# EAGLE schematic POCN_Vrevised (EAGLE 9.6.2)
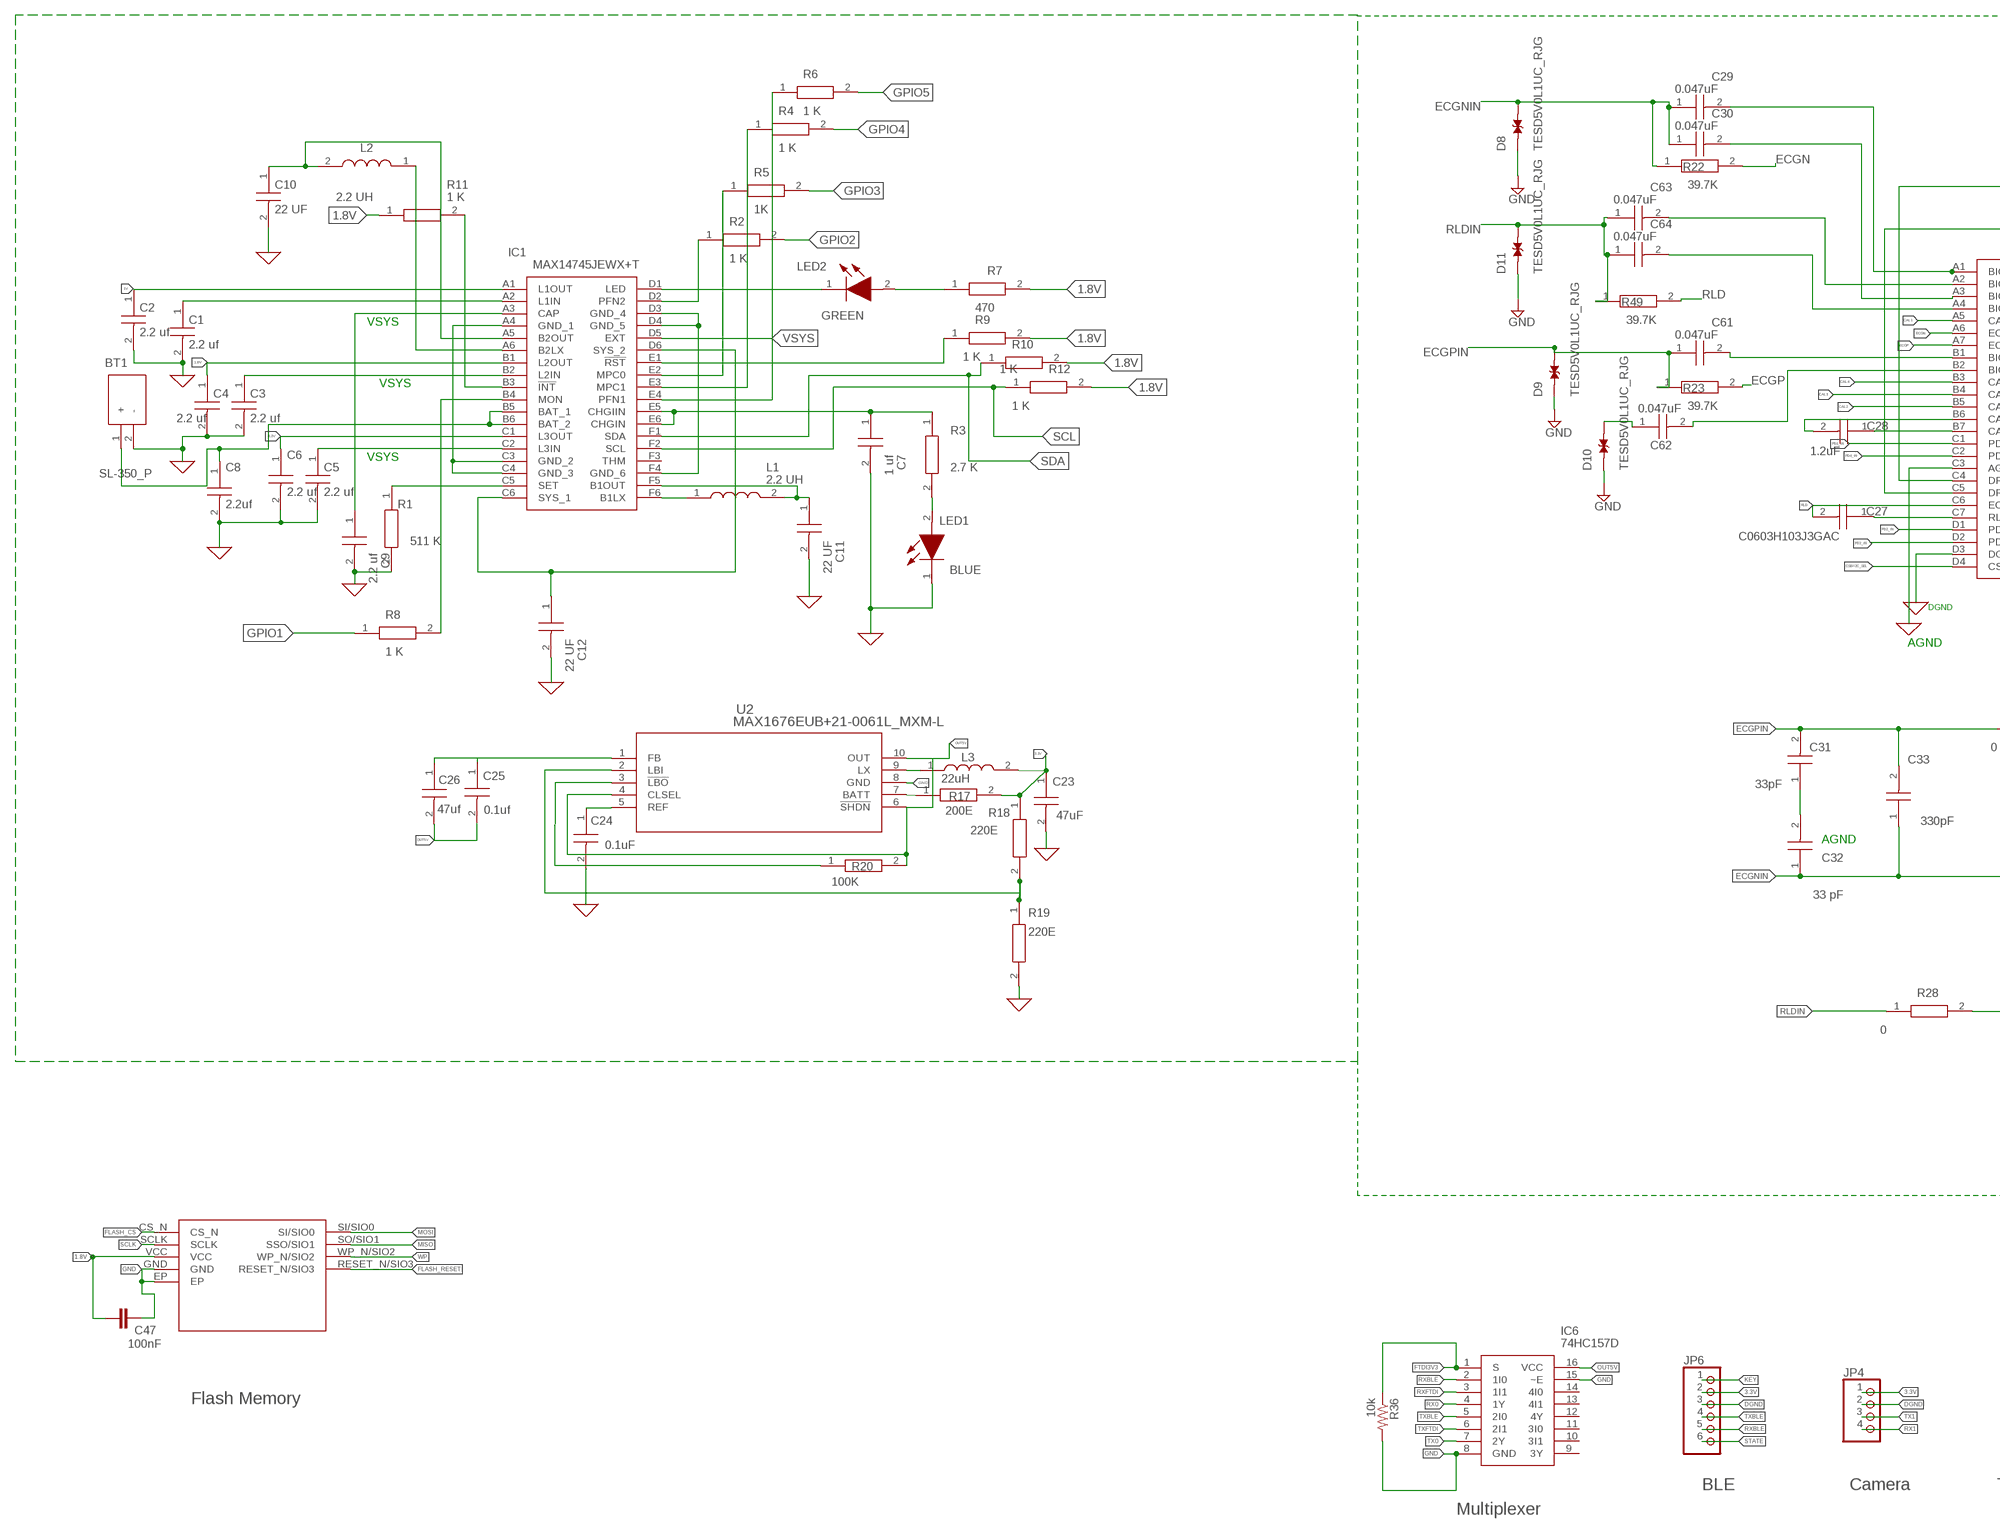
[diagram p0: schematic, sheet 1, part 1 of 3]
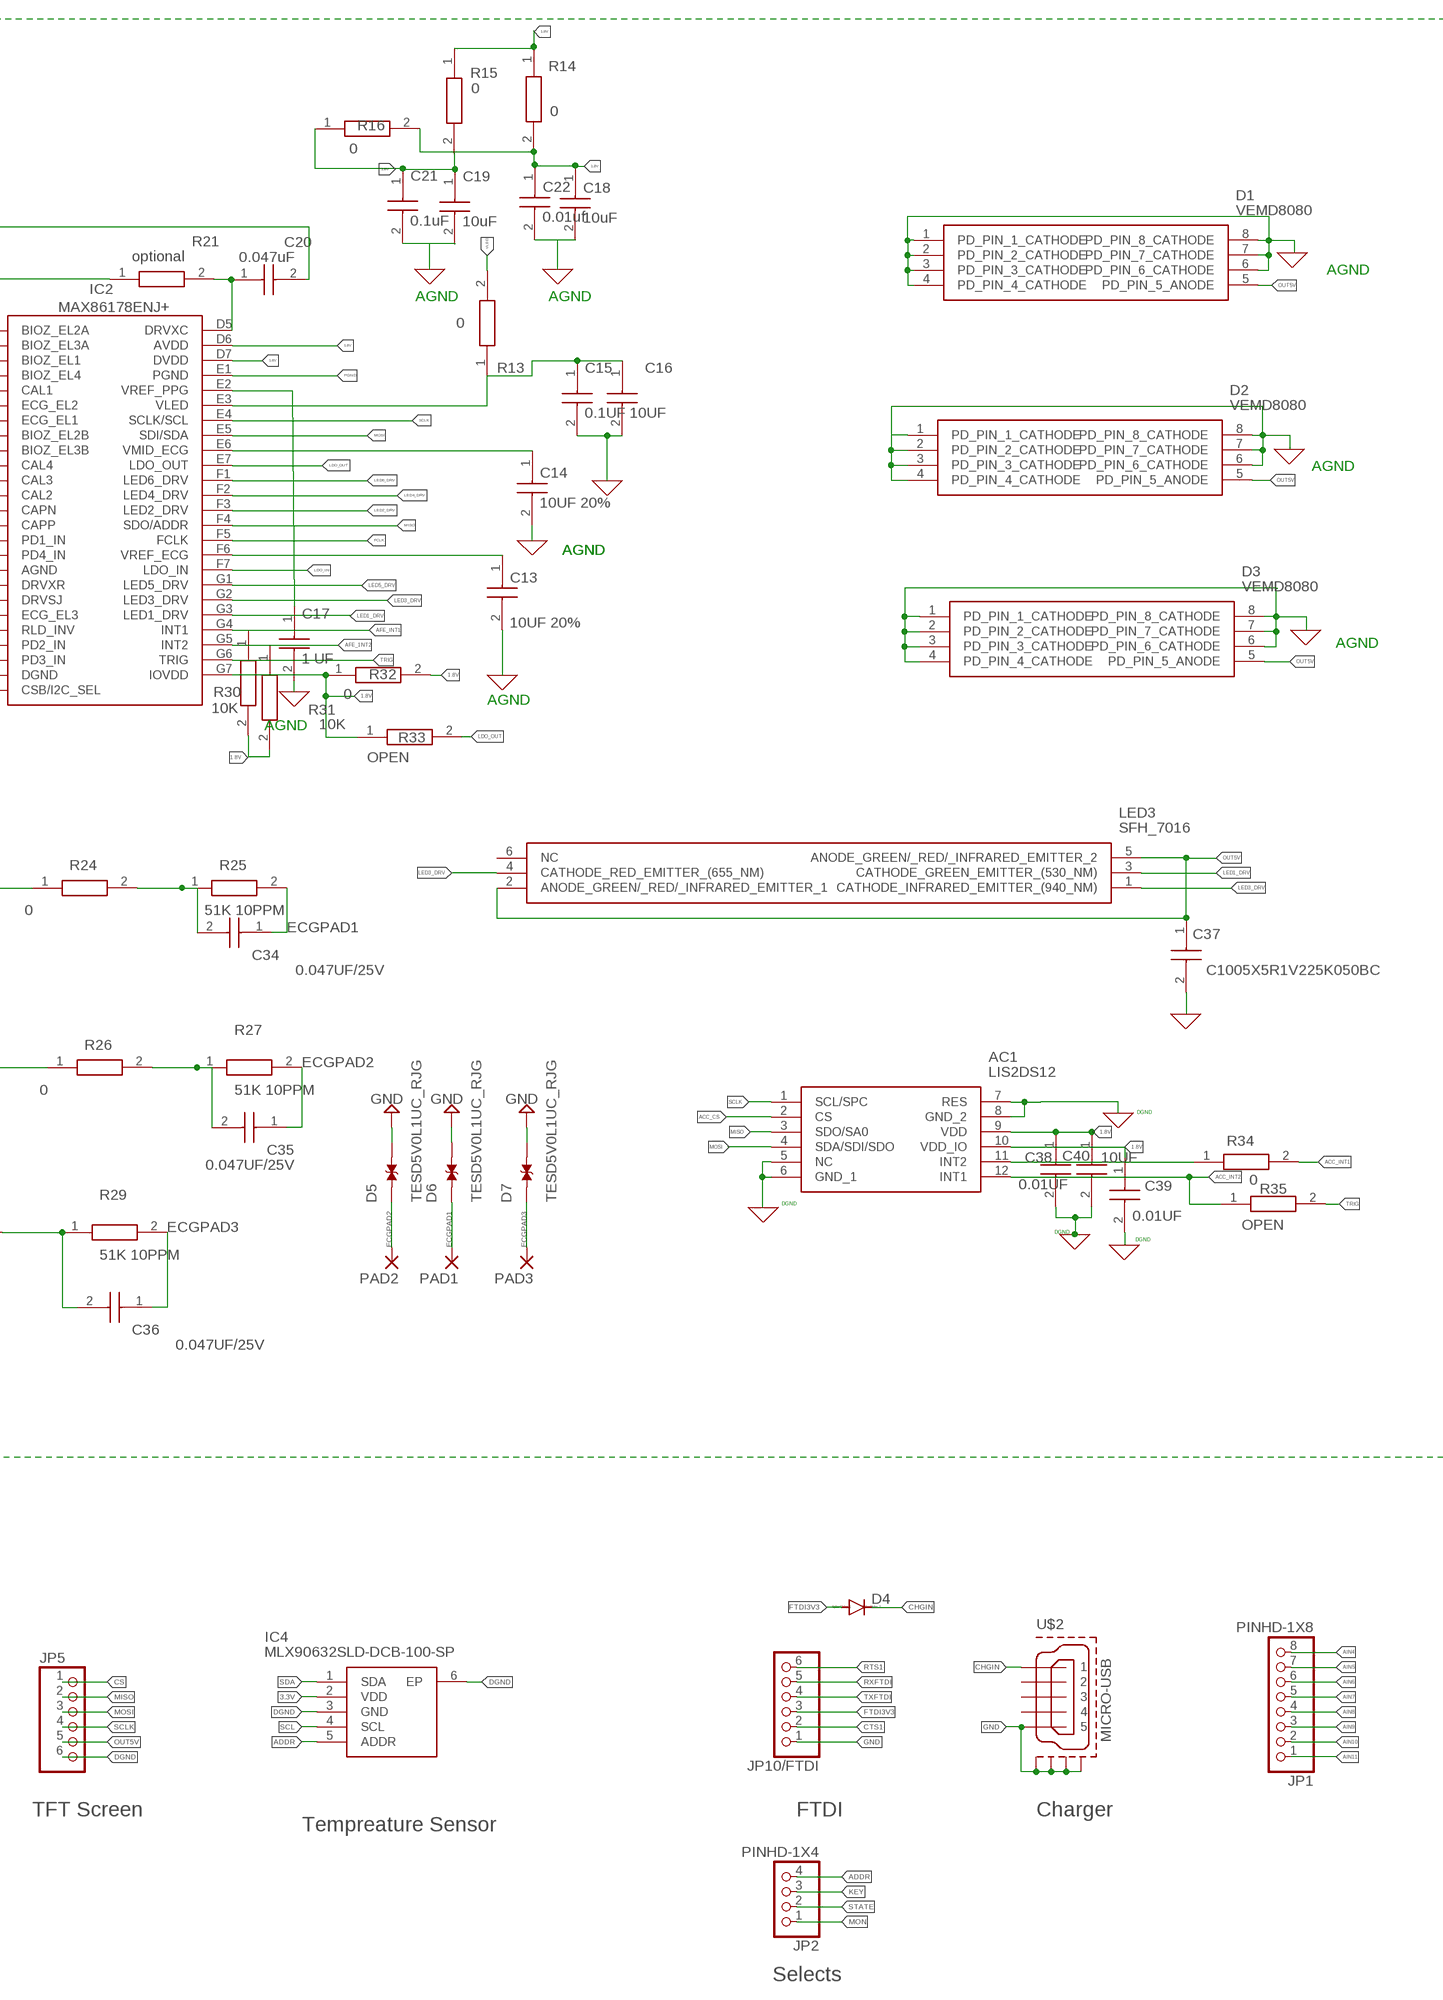
[diagram p1: schematic, sheet 1, part 2 of 3]
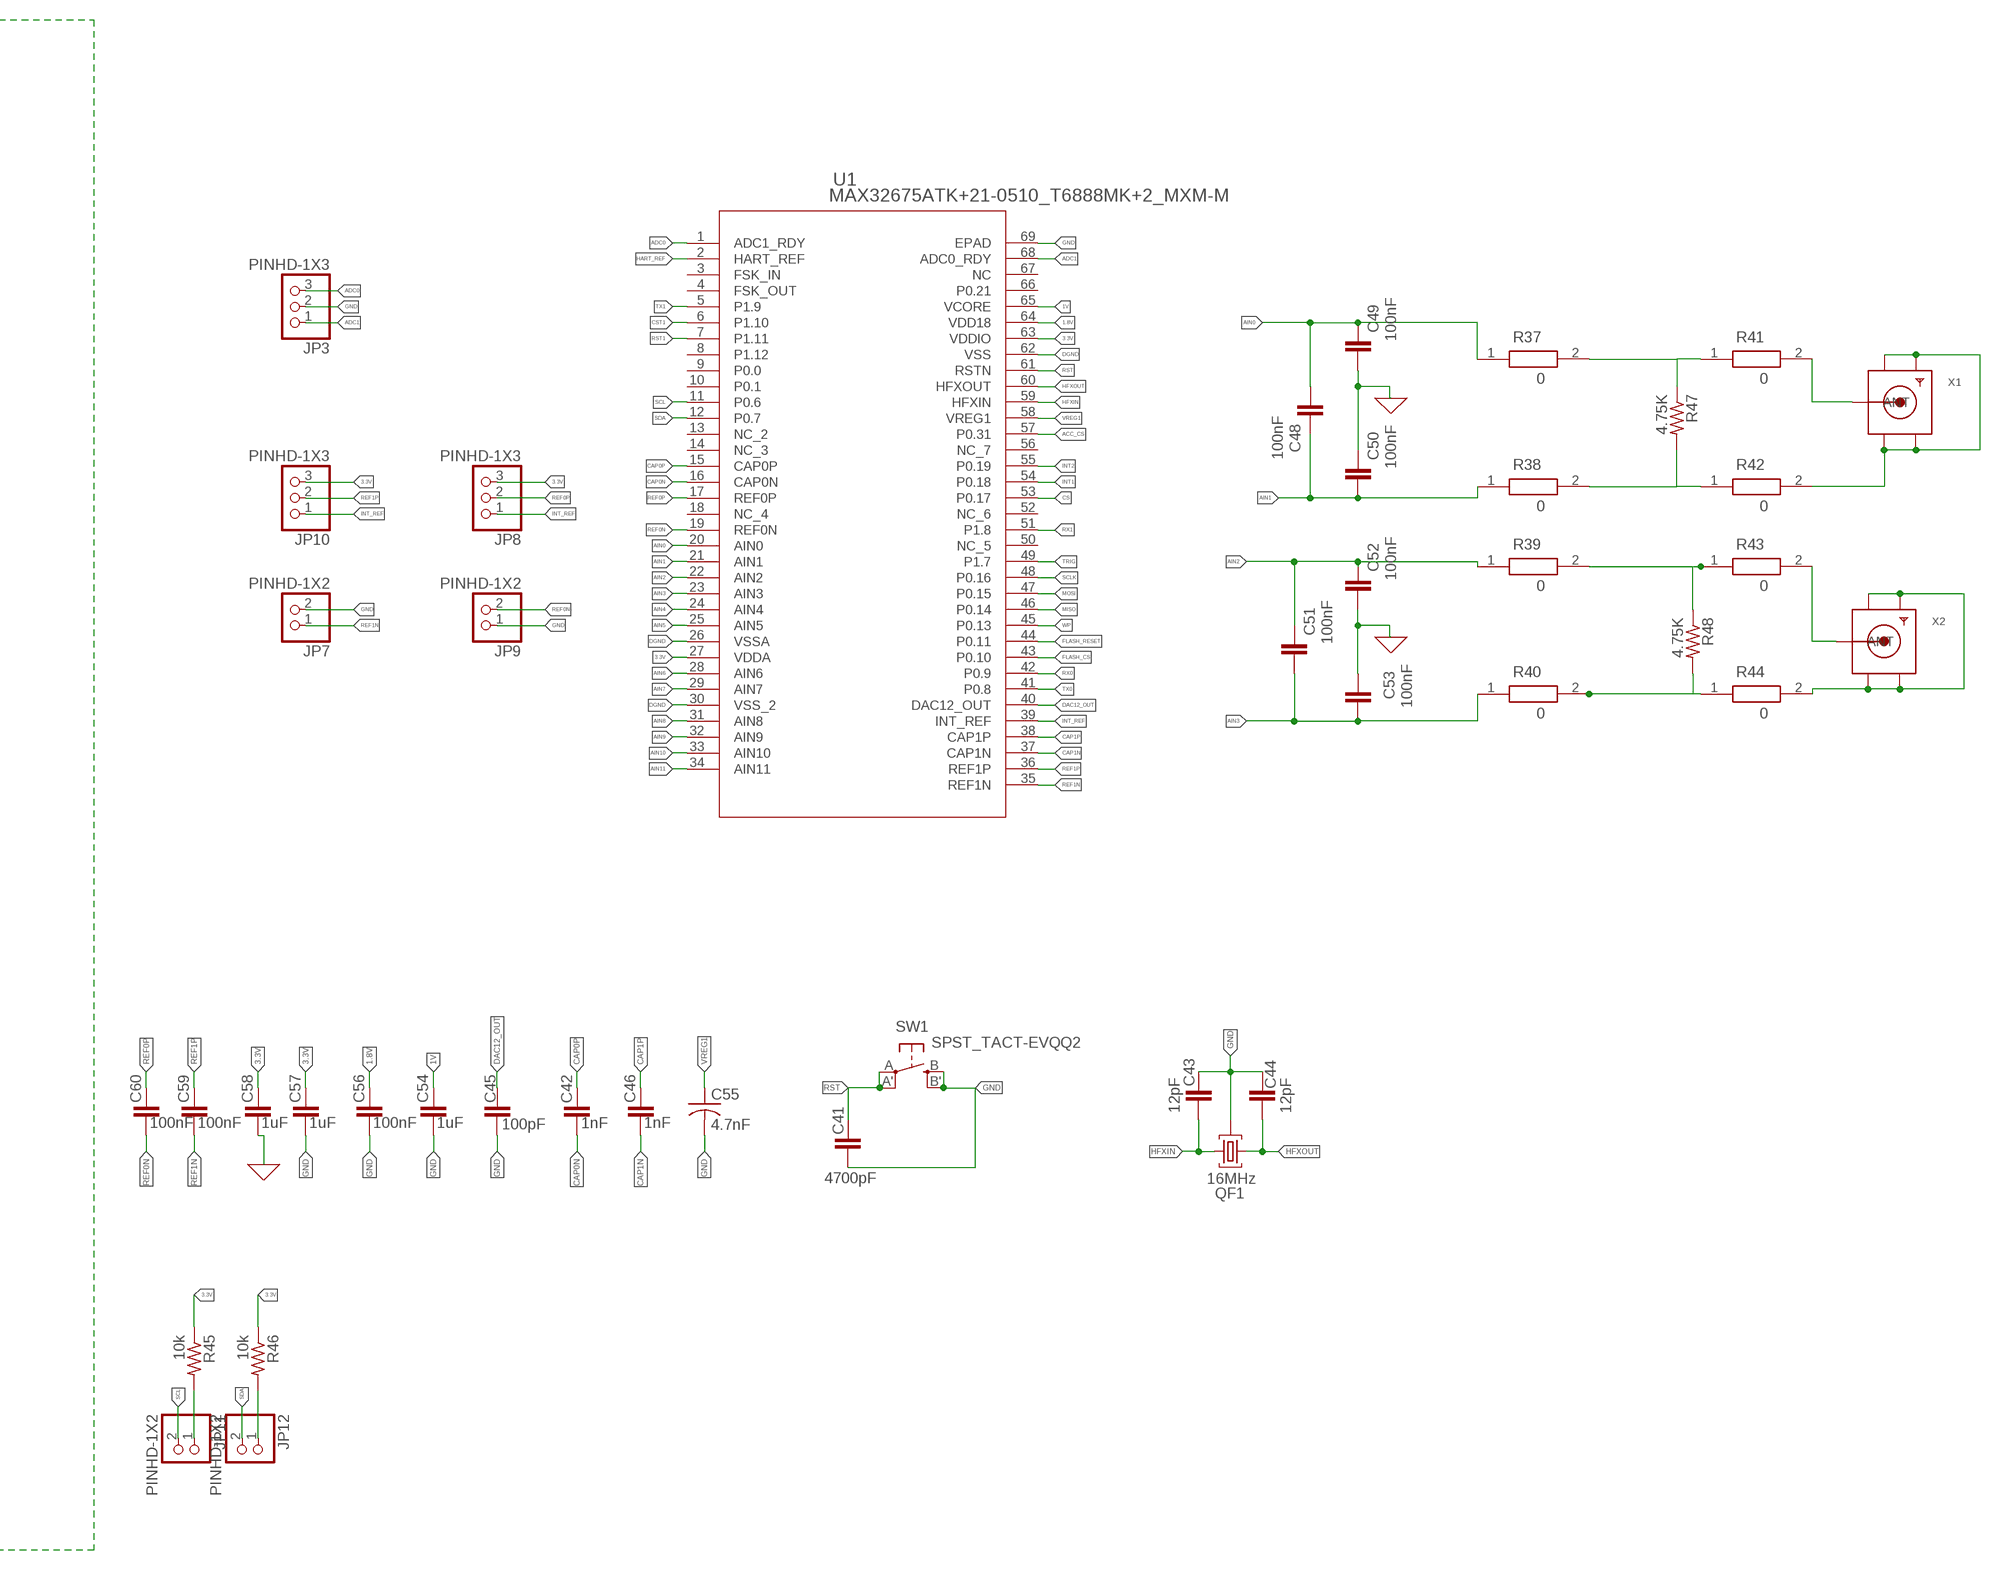
[diagram p2: schematic, sheet 1, part 3 of 3]

## Parts
AC1  LIS2DS12  [LGA-12]
BT1  SL-350_P  [SL350P]
C1  2.2 uf  C1005X5R1V225K050BC  [C1005_COMMERCIAL]
C2  2.2 uf  C1005X5R1V225K050BC  [C1005_COMMERCIAL]
C3  2.2 uf  C1005X5R1V225K050BC  [C1005_COMMERCIAL]
C4  2.2 uf  C1005X5R1V225K050BC  [C1005_COMMERCIAL]
C5  2.2 uf  C1005X5R1V225K050BC  [C1005_COMMERCIAL]
C6  2.2 uf  C1005X5R1V225K050BC  [C1005_COMMERCIAL]
C7  1 uf  C1005X5R1V225K050BC  [C1005_COMMERCIAL]
C8  2.2uf  C1005X5R1V225K050BC  [C1005_COMMERCIAL]
C9  2.2 uf  C1005X5R1V225K050BC  [C1005_COMMERCIAL]
C10  22 UF  GRM188R60J226ME15D  [CAPC1608X90N]
C11  22 UF  GRM188R60J226ME15D  [CAPC1608X90N]
C12  22 UF  GRM188R60J226ME15D  [CAPC1608X90N]
C13  10UF 20%  GRM188R60J226ME15D  [CAPC1608X90N]
C14  10UF 20%  GRM188R60J226ME15D  [CAPC1608X90N]
C15  0.1UF  GRM188R60J226ME15D  [CAPC1608X90N]
C16  10UF  C1005X5R1V225K050BC  [C1005_COMMERCIAL]
C17  1 UF  C0603H103J3GAC  [C0603]
C18  10uF  C0603H103J3GAC  [C0603]
C19  10uF  C0603H103J3GAC  [C0603]
C20  0.047uF  C1005X5R1V225K050BC  [C1005_COMMERCIAL]
C21  0.1uF  C1005X5R1V225K050BC  [C1005_COMMERCIAL]
C22  0.01uf  C1005X5R1V225K050BC  [C1005_COMMERCIAL]
C23  47uF  C0603H103J3GAC  [C0603]
C24  0.1uF  C1005X5R1V225K050BC  [C1005_COMMERCIAL]
C25  0.1uf  C1005X5R1V225K050BC  [C1005_COMMERCIAL]
C26  47uf  C0603H103J3GAC  [C0603]
C27  C0603H103J3GAC  [C0603]
C28  1.2uF  C0603H103J3GAC  [C0603]
C29  0.047uF  C1005X5R1V225K050BC  [C1005_COMMERCIAL]
C30  0.047uF  C1005X5R1V225K050BC  [C1005_COMMERCIAL]
C31  33pF  C0603H103J3GAC  [C0603]
C32  33 pF  C0603H103J3GAC  [C0603]
C33  330pF  C0603H103J3GAC  [C0603]
C34  0.047UF/25V  C0603H103J3GAC  [C0603]
C35  0.047UF/25V  C0603H103J3GAC  [C0603]
C36  0.047UF/25V  C0603H103J3GAC  [C0603]
C37  C1005X5R1V225K050BC  [C1005_COMMERCIAL]
C38  0.01UF  C1005X5R1V225K050BC  [C1005_COMMERCIAL]
C39  0.01UF  C1005X5R1V225K050BC  [C1005_COMMERCIAL]
C40  10UF  C0805C125K4RACTU  [CAPC2012X88N]
C41  4700pF  C-EUC0805  [C0805]
C42  1nF  C-EUC0805  [C0805]
C43  12pF  C-EUC0805  [C0805]
C44  12pF  C-EUC0805  [C0805]
C45  100pF  C-EUC0805  [C0805]
C46  1nF  C-EUC0805  [C0805]
C47  100nF  C-EUC0805  [C0805]
C48  100nF  C-EUC0805  [C0805]
C49  100nF  C-EUC0805  [C0805]
C50  100nF  C-EUC0805  [C0805]
C51  100nF  C-EUC0805  [C0805]
C52  100nF  C-EUC0805  [C0805]
C53  100nF  C-EUC0805  [C0805]
C54  1uF  C-EUC0805  [C0805]
C55  4.7nF  C-USC0402  [C0402]
C56  100nF  C-EUC0805  [C0805]
C57  1uF  C-EUC0805  [C0805]
C58  1uF  C-EUC0805  [C0805]
C59  100nF  C-EUC0805  [C0805]
C60  100nF  C-EUC0805  [C0805]
C61  0.047uF  C1005X5R1V225K050BC  [C1005_COMMERCIAL]
C62  0.047uF  C1005X5R1V225K050BC  [C1005_COMMERCIAL]
C63  0.047uF  C1005X5R1V225K050BC  [C1005_COMMERCIAL]
C64  0.047uF  C1005X5R1V225K050BC  [C1005_COMMERCIAL]
D1  VEMD8080  [VEMD8080]
D2  VEMD8080  [VEMD8080]
D3  VEMD8080  [VEMD8080]
D4  CGRM4001-G  [SOD-123_MINI-SMA]
D5  TESD5V0L1UC_RJG  [DIO_TESD5V0L1UC_RJG]
D6  TESD5V0L1UC_RJG  [DIO_TESD5V0L1UC_RJG]
D7  TESD5V0L1UC_RJG  [DIO_TESD5V0L1UC_RJG]
D8  TESD5V0L1UC_RJG  [DIO_TESD5V0L1UC_RJG]
D9  TESD5V0L1UC_RJG  [DIO_TESD5V0L1UC_RJG]
D10  TESD5V0L1UC_RJG  [DIO_TESD5V0L1UC_RJG]
D11  TESD5V0L1UC_RJG  [DIO_TESD5V0L1UC_RJG]
IC1  MAX14745JEWX+T  [BGA36C40P6X6_269X244X69]
IC2  MAX86178ENJ+  [BGA49C35P7X7_277X257X50]
IC4  MLX90632SLD-DCB-100-SP  [MLX90632SLDDCB100SP]
IC6  74HC157D  [SOIC127P600X175-16N]
JP1  PINHD-1X8  [1X08]
JP2  PINHD-1X4  [1X04]
JP3  PINHD-1X3  [1X03]
JP4  PINHD-1X4  [1X04]
JP5  PINHD-1X6  [1X06]
JP6  PINHD-1X6  [1X06]
JP7  PINHD-1X2  [1X02]
JP8  PINHD-1X3  [1X03]
JP9  PINHD-1X2  [1X02]
JP10  PINHD-1X3  [1X03]
JP10/FTDI  PINHD-1X6  [1X06]
JP11  PINHD-1X2  [1X02]
JP12  PINHD-1X2  [1X02]
L1  2.2 UH  DFE201610E-2R2M=P2  [1285ASH1R0MP2]
L2  2.2 UH  DFE201610E-2R2M=P2  [1285ASH1R0MP2]
L3  22uH  DFE201610E-2R2M=P2  [1285ASH1R0MP2]
LED1  BLUE  LG_L29K-G2J1-24  [LEDM178X67N]
LED2  GREEN  LG_L29K-G2J1-24  [LEDM178X67N]
LED3  SFH_7016  [SFH7016]
PAD1  SMD5  [SMD2,54-5,08]
PAD2  SMD5  [SMD2,54-5,08]
PAD3  SMD5  [SMD2,54-5,08]
QF1  16MHz  8M10AHC49T  [HC49U]
R1  511 K  CRCW0402499RFKED  [RESC1005X40N]
R2  1 K  CRCW0402499RFKED  [RESC1005X40N]
R3  2.7 K  CRCW0402499RFKED  [RESC1005X40N]
R4  1 K  CRCW0402499RFKED  [RESC1005X40N]
R5  1K  CRCW0402499RFKED  [RESC1005X40N]
R6  1 K  CRCW0402499RFKED  [RESC1005X40N]
R7  470  CRCW0402499RFKED  [RESC1005X40N]
R8  1 K  CRCW0402499RFKED  [RESC1005X40N]
R9  1 K  CRCW0402499RFKED  [RESC1005X40N]
R10  1 K  CRCW0402499RFKED  [RESC1005X40N]
R11  1 K  CRCW0402499RFKED  [RESC1005X40N]
R12  1 K  CRCW0402499RFKED  [RESC1005X40N]
R13  0  CRCW0402499RFKED  [RESC1005X40N]
R14  0  CRCW0402499RFKED  [RESC1005X40N]
R15  0  CRCW0402499RFKED  [RESC1005X40N]
R16  0  CRCW0402499RFKED  [RESC1005X40N]
R17  200E  CRCW0402499RFKED  [RESC1005X40N]
R18  220E  CRCW0402499RFKED  [RESC1005X40N]
R19  220E  CRCW0402499RFKED  [RESC1005X40N]
R20  100K  CRCW0402499RFKED  [RESC1005X40N]
R21  optional  CRCW0402499RFKED  [RESC1005X40N]
R22  39.7K  CRCW0402499RFKED  [RESC1005X40N]
R23  39.7K  CRCW0402499RFKED  [RESC1005X40N]
R24  0  CRCW060310K0FKEI  [RESC1608X50N]
R25  51K 10PPM  CRCW060310K0FKEI  [RESC1608X50N]
R26  0  CRCW060310K0FKEI  [RESC1608X50N]
R27  51K 10PPM  CRCW060310K0FKEI  [RESC1608X50N]
R28  0  CRCW060310K0FKEI  [RESC1608X50N]
R29  51K 10PPM  CRCW060310K0FKEI  [RESC1608X50N]
R30  10K  CRCW060310K0FKEI  [RESC1608X50N]
R31  10K  CRCW060310K0FKEI  [RESC1608X50N]
R32  0  CRCW060310K0FKEI  [RESC1608X50N]
R33  OPEN  CRCW060310K0FKEI  [RESC1608X50N]
R34  0  CRCW0402499RFKED  [RESC1005X40N]
R35  OPEN  CRCW0402499RFKED  [RESC1005X40N]
R36  10k  R-US_M1206  [M1206]
R37  0  CRCW0402499RFKED  [RESC1005X40N]
R38  0  CRCW0402499RFKED  [RESC1005X40N]
R39  0  CRCW0402499RFKED  [RESC1005X40N]
R40  0  CRCW0402499RFKED  [RESC1005X40N]
R41  0  CRCW0402499RFKED  [RESC1005X40N]
R42  0  CRCW0402499RFKED  [RESC1005X40N]
R43  0  CRCW0402499RFKED  [RESC1005X40N]
R44  0  CRCW0402499RFKED  [RESC1005X40N]
R45  10k  R-US_M1206  [M1206]
R46  10k  R-US_M1206  [M1206]
R47  4.75K  R-US_M1206  [M1206]
R48  4.75K  R-US_M1206  [M1206]
R49  39.7K  CRCW0402499RFKED  [RESC1005X40N]
SW1  SPST_TACT-EVQQ2  [EVQ-Q2]
U1  MAX32675ATK+21-0510_T6888MK+2_MXM-M  [21-0510_T6888MK+2_MXM-M]
U2  MAX1676EUB+21-0061L_MXM-L  [21-0061L_MXM-L]
U$1  FLASH  [SON127P600X800X80-9N]
U$2  MICRO-USB  MICRO-USB-RECEPTACLE47589-0001  [47589-0001]
X1  SMACONNECTOR  [SMA90_DIP]
X2  SMACONNECTOR  [SMA90_DIP]

## Nets
1.8V: AC1.9(VDD) AC1.10(VDD_IO) C4.1 C18.1 C19.1 C21.1 C22.1 C38.1 C39.1 C40.1 C47.1 C56.2 IC1.B1(L2OUT) IC2.D6(AVDD) IC2.D7(DVDD) R7.2 R9.2 R10.2 R11.1 R12.2 R14.1 R14.2 R15.1 R15.2 R16.1 R16.2 R30.2 R31.2 R32.2 U1.64(VDD18) U$1.VCC
1V: C2.1 C54.2 IC1.A1(L1OUT) U1.65(VCORE)
3.3V: C6.1 C23.1 C57.2 C58.2 IC1.C1(L3OUT) IC4.2(VDD) JP4.1 JP6.2 JP8.3 JP10.3 L3.2 R17.2 R18.1 R45.1 R46.1 U1.27(VDDA) U1.63(VDDIO)
ACC_CS: AC1.2(CS) U1.57(P0.31)
ACC_INT1: R34.2
ACC_INT2: AC1.12(INT1) R35.1
ADC0: JP3.3 U1.1(ADC1_RDY)
ADC1: JP3.1 U1.68(ADC0_RDY)
ADDR: IC4.5(ADDR) JP2.4
AFE_1NT2: IC2.G5(INT2)
AFE_INT1: IC2.G4(INT1)
AGND: AC1.7(RES) AC1.8(GND_2) BT1.2(-) C1.2 C2.2 C3.2 C4.2 C5.2 C6.2 C7.2 C8.2 C9.2 C10.2 C11.2 C12.2 C13.2 C14.2 C15.2 C16.2 C17.2 C23.2 C24.2 C49.1 C50.2 C52.1 C53.2 C58.1 LED1.1(K) R1.2 R19.2 ; supply symbol labelled GND
AIN0: C48.1 C49.2 R37.1 U1.20(AIN0)
AIN1: C48.2 C50.1 R38.1 U1.21(AIN1)
AIN2: C51.2 C52.2 R39.1 U1.22(AIN2)
AIN3: C51.1 C53.1 R40.1 U1.23(AIN3)
AIN4: JP1.8 U1.24(AIN4)
AIN5: JP1.7 U1.25(AIN5)
AIN6: JP1.6 U1.28(AIN6)
AIN7: JP1.5 U1.29(AIN7)
AIN8: JP1.4 U1.31(AIN8)
AIN9: JP1.3 U1.32(AIN9)
AIN10: JP1.2 U1.33(AIN10)
AIN11: JP1.1 U1.34(AIN11)
CAL1: IC2.A5(CAL1)
CAL2: IC2.B5(CAL2)
CAL3: IC2.B4(CAL3)
CAL4: IC2.B3(CAL4)
CAP0N: C42.2 U1.16(CAP0N)
CAP0P: C42.1 U1.15(CAP0P)
CAP1N: C46.1 U1.37(CAP1N)
CAP1P: C46.2 U1.38(CAP1P)
CHGIN: D4.C U$2.1
CS: JP5.1 U1.53(P0.17)
CSB/I2C_SEL: IC2.D4(CSB/I2C_SEL)
CST1: U1.6(P1.10)
CTS1: JP10/FTDI.2
DAC12_OUT: C45.1 U1.40(DAC12_OUT)
DGND: IC4.3(GND) IC4.6(EP) JP4.2 JP5.6 JP6.3 U1.26(VSSA) U1.30(VSS_2) U1.62(VSS)
ECGN: IC2.A6(ECG_EL2) R22.2
ECGNIN: C29.1 C30.1 C32.1 C33.1 D8.2 R22.1 R26.1
ECGP: IC2.A7(ECG_EL1) R23.2
ECGPAD1: C34.1 D6.1 PAD1.1(P) R25.2
ECGPAD2: C35.1 D5.1 PAD2.1(P) R27.2
ECGPAD3: C36.1 D7.1 PAD3.1(P) R29.2
ECGPIN: C31.2 C33.2 C61.1 D9.2 R23.1 R24.1
FCLK: IC2.F5(FCLK)
FLASH_CS: U1.43(P0.10) U$1.CS_N
FLASH_RESET: U1.44(P0.11) U$1.RESET_N/SIO3
FTDI3V3: D4.A IC6.1(S) JP10/FTDI.3 R36.1
GND: C41.2 C43.1 C44.1 C45.2 C47.2 C54.1 C55.2 C56.1 C57.1 D5.2 D6.2 D7.2 D8.1 D9.1 D10.1 D11.1 IC6.8(GND) IC6.15(~E) JP3.2 JP7.2 JP9.1 JP10/FTDI.1 QF1.2 R36.2 SW1.B'(S1) SW1.B(S) U1.69(EPAD) U2.8(GND) U$1.EP U$1.GND U$2.5 U$2.CASING1(GND1) U$2.CASING2(GND2) U$2.CASING3(GND3) U$2.CASING4(GND4)
GPIO1: R8.1
GPIO2: R2.2
GPIO3: R5.2
GPIO4: R4.2
GPIO5: R6.2
HART_REF: U1.2(HART_REF)
HFXIN: C43.2 QF1.3 U1.59(HFXIN)
HFXOUT: C44.2 QF1.1 U1.60(HFXOUT)
INT1: U1.54(P0.18)
INT2: U1.55(P0.19)
INT_REF: JP8.1 JP10.1 U1.39(INT_REF)
KEY: JP2.3 JP6.1
LDO_IN: IC2.F7(LDO_IN)
LDO_OUT: IC2.E7(LDO_OUT) R33.2
LED1_DRV: IC2.G3(LED1_DRV) LED3.3(CATHODE_GREEN_EMITTER_(530_NM))
LED2_DRV: IC2.F3(LED2_DRV)
LED3_DRV: IC2.G2(LED3_DRV) LED3.1(CATHODE_INFRARED_EMITTER_(940_NM)) LED3.4(CATHODE_RED_EMITTER_(655_NM))
LED4_DRV: IC2.F2(LED4_DRV)
LED5_DRV: IC2.G1(LED5_DRV)
LED6_DRV: IC2.F1(LED6_DRV)
MISO: AC1.3(SDO/SA0) IC2.F4(SDO/ADDR) JP5.2 U1.46(P0.14) U$1.SO/SIO1(SSO/SIO1)
MON: JP2.1
MOSI: AC1.4(SDA/SDI/SDO) IC2.E5(SDI/SDA) JP5.3 U1.47(P0.15) U$1.SI/SIO0
N$1: C7.1 IC1.E5(CHGIIN) IC1.E6(CHGIN) R3.1
N$2: C1.1 IC1.A2(L1IN)
N$3: C37.2
N$4: C3.1 IC1.B2(L2IN)
N$5: D1.1(PD_PIN_1_CATHODE) D1.2(PD_PIN_2_CATHODE) D1.3(PD_PIN_3_CATHODE) D1.4(PD_PIN_4_CATHODE) D1.6(PD_PIN_6_CATHODE) D1.7(PD_PIN_7_CATHODE) D1.8(PD_PIN_8_CATHODE)
N$6: C5.1 IC1.C2(L3IN)
N$7: AC1.5(NC) AC1.6(GND_1)
N$8: IC1.A4(GND_1) IC1.C3(GND_2) IC1.C4(GND_3)
N$9: IC1.C5(SET) R1.1
N$10: IC1.D3(GND_4) IC1.D4(GND_5) IC1.F4(GND_6)
N$11: LED1.2(A) R3.2
N$12: BT1.1(+) C8.1 IC1.B5(BAT_1) IC1.B6(BAT_2)
N$13: IC1.D1(LED) LED2.1(K)
N$14: LED2.2(A) R7.1
N$15: C9.1 IC1.A3(CAP)
N$16: IC1.F6(B1LX) L1.1
N$17: C11.1 IC1.F5(B1OUT) L1.2
N$18: IC1.A6(B2LX) L2.1
N$19: C10.1 IC1.A5(B2OUT) L2.2
N$20: C12.1 IC1.C6(SYS_1) IC1.D6(SYS_2)
N$21: IC1.B4(MON) R8.2
N$22: IC1.D2(PFN2) R2.1
N$23: IC1.E2(MPC0) R5.1
N$24: R17.1 U2.7(BATT)
N$25: IC1.E3(MPC1) R4.1
N$26: C13.1 IC2.F6(VREF_ECG)
N$27: IC1.E4(PFN1) R6.1
N$28: IC1.E1(!RST) R9.1
N$29: IC1.B3(!INT) R11.2
N$30: C14.1 IC2.E6(VMID_ECG)
N$31: IC2.E3(VLED)
N$32: C17.1 IC2.E2(VREF_PPG)
N$33: C15.1 C16.1 R13.1
N$35: R18.2 R19.1 U2.2(LBI)
N$36: L3.1 U2.9(LX)
N$37: R20.2 U2.6(!SHDN)
N$38: U2.3(!LBO)
N$40: R20.1
N$41: U2.4(CLSEL)
N$42: U2.10(OUT)
N$43: U2.1(FB)
N$44: C24.1 U2.5(REF)
N$45: C26.1
N$46: C20.1 IC2.D5(DRVXC) R21.2
N$47: C19.2 C21.2
N$48: C18.2 C22.2
N$49: C20.2 IC2.C4(DRVXR)
N$50: IC2.C5(DRVSJ) R21.1
N$51: C27.1 IC2.C7(RLD_INV)
N$52: IC2.D3(DGND)
N$53: IC2.C3(AGND)
N$55: IC2.B7(CAPP)
N$56: C28.2 IC2.B6(CAPN)
N$57: C30.2 IC2.A3(BIOZ_EL1)
N$60: C61.2 IC2.B1(BIOZ_EL2B)
N$61: C62.1 D10.2
N$62: C62.2 IC2.B2(BIOZ_EL3B)
N$64: C63.2 IC2.A2(BIOZ_EL3A)
N$65: C64.2 IC2.A4(BIOZ_EL4)
N$67: C29.2 IC2.A1(BIOZ_EL2A)
N$68: D3.1(PD_PIN_1_CATHODE) D3.2(PD_PIN_2_CATHODE) D3.3(PD_PIN_3_CATHODE) D3.4(PD_PIN_4_CATHODE) D3.6(PD_PIN_6_CATHODE) D3.7(PD_PIN_7_CATHODE) D3.8(PD_PIN_8_CATHODE)
N$69: C35.2 R26.2 R27.1
N$70: C31.1 C32.2
N$71: D2.1(PD_PIN_1_CATHODE) D2.2(PD_PIN_2_CATHODE) D2.3(PD_PIN_3_CATHODE) D2.4(PD_PIN_4_CATHODE) D2.6(PD_PIN_6_CATHODE) D2.7(PD_PIN_7_CATHODE) D2.8(PD_PIN_8_CATHODE)
N$72: C34.2 R24.2 R25.1
N$76: C36.2 R28.2 R29.1
N$78: IC2.G7(IOVDD) R32.1 R33.1
N$79: JP11.1 R45.2
N$80: R37.2 R41.1 R47.1
N$81: JP12.1 R46.2
N$82: AC1.11(INT2) R34.1
N$84: C38.2 C40.2
N$86: C39.2
N$87: R38.2 R42.1 R47.2
N$88: R39.2 R43.1 R48.1
N$89: R40.2 R44.1 R48.2
N$90: R41.2 X1.ANTENNA(ANT)
N$91: R42.2 X1.GND1 X1.GND2 X1.GND3 X1.GND4
N$93: R43.2 X2.ANTENNA(ANT)
N$94: R44.2 X2.GND1 X2.GND2 X2.GND3 X2.GND4
OUT5V: C25.2 C26.2 C37.1 D1.5(PD_PIN_5_ANODE) D2.5(PD_PIN_5_ANODE) D3.5(PD_PIN_5_ANODE) IC6.16(VCC) JP5.5 LED3.2(ANODE_GREEN/_RED/_INFRARED_EMITTER_1) LED3.5(ANODE_GREEN/_RED/_INFRARED_EMITTER_2)
PD1_IN: IC2.C1(PD1_IN)
PD2_IN: IC2.D1(PD2_IN)
PD3_IN: IC2.D2(PD3_IN)
PD4_IN: IC2.C2(PD4_IN)
PGND: IC2.E1(PGND)
REF0N: C60.1 JP9.2 U1.19(REF0N)
REF0P: C60.2 JP8.2 U1.17(REF0P)
REF1N: C59.1 JP7.1 U1.35(REF1N)
REF1P: C59.2 JP10.2 U1.36(REF1P)
RLD: C27.2 IC2.C6(ECG_EL3) R49.2
RLDIN: C63.1 C64.1 D11.2 R28.1 R49.1
RST: C41.1 SW1.A'(P1) SW1.A(P) U1.61(RSTN)
RST1: U1.7(P1.11)
RTS1: JP10/FTDI.6
RX0: IC6.4(1Y) U1.42(P0.9)
RX1: JP4.4 U1.51(P1.8)
RXBLE: IC6.2(1I0) JP6.5
RXFTDI: IC6.3(1I1) JP10/FTDI.5
SCL: IC1.F2(SCL) IC4.4(SCL) JP11.2 R12.1 U1.11(P0.6)
SCLK: AC1.1(SCL/SPC) IC2.E4(SCLK/SCL) JP5.4 U1.48(P0.16) U$1.SCLK
SDA: IC1.F1(SDA) IC4.1(SDA) JP12.2 R10.1 U1.12(P0.7)
STATE: JP2.2 JP6.6
TRIG: IC2.G6(TRIG) R35.2 U1.49(P1.7)
TX0: IC6.7(2Y) U1.41(P0.8)
TX1: JP4.3 U1.5(P1.9)
TXBLE: IC6.5(2I0) JP6.4
TXFTDI: IC6.6(2I1) JP10/FTDI.4
VLED: R13.2
VREG1: C55.1 U1.58(VREG1)
VSYS: IC1.D5(EXT)
WP: U1.45(P0.13) U$1.WP_N/SIO2
Unconnected: C25.1 C28.1 IC1.F3(THM) IC6.9(3Y) IC6.10(3I1) IC6.11(3I0) IC6.12(4Y) IC6.13(4I1) IC6.14(4I0) LED3.6(NC) R30.1 R31.1 U1.3(FSK_IN) U1.4(FSK_OUT) U1.8(P1.12) U1.9(P0.0) U1.10(P0.1) U1.13(NC_2) U1.14(NC_3) U1.18(NC_4) U1.50(NC_5) U1.52(NC_6) U1.56(NC_7) U1.66(P0.21) U1.67(NC) U$2.2 U$2.3 U$2.4

## Notes on the sheet
- AGND
- AGND | AGND
- VSYS
- VSYS | AGND
- AGND | AGND
- VSYS
- AGND
- AGND
- AGND
- DGND
- AGND
- AGND
- DGND
- DGND
- DGND
- DGND
- Flash Memory
- BLE | Camera | TFT Screen | FTDI | Charger
- Tempreature Sensor
- Multiplexer
- Selects

## Library data of the parts
AC1 = LIS2DS12:LIS2DS12: STMicroelectronics LIS2DS12 3-Axis Accelerometer Ic, 1.62 1.98 V 12-Pin LGA Source: Datasheet <http://www.st.com/content/ccc/resource/technical/document/datasheet/ce/32/55/ac/e1/87/46/84/DM00177048.pdf/files/DM00177048.pdf/jcr:content/translations/en.DM00177048.pdf>; DESCRIPTION: STMicroelectronics LIS2DS12 3-Axis Accelerometer Ic, 1.62 1.98 V 12-Pin LGA; HEIGHT: mm; MANUFACTURER_NAME: STMicroelectronics; MANUFACTURER_PART_NUMBER: LIS2DS12
BT1 = SL-350_P:SL-350_P: SL 350-P Tadiran With Pin Tadiran Lithium Battery, Voltage: 3.6 V, Capacity: 1.1 Ah Source: Datasheet; DESCRIPTION: SL 350-P Tadiran With Pin Tadiran Lithium Battery, Voltage: 3.6 V, Capacity: 1.1 Ah; HEIGHT: 14.7mm; MANUFACTURER_NAME: Tadiran Batteries; MANUFACTURER_PART_NUMBER: SL-350/P
C1-C9 C16 C20-C22 C24 C25 C29 C30 C37-C39 C61-C64 = C1005X5R1V225K050BC:C1005X5R1V225K050BC: MULTILAYER CERAMIC CHIP CAPACITORS, 1005, Commercial grade, general (Up to 75V) Source: Datasheet <https://product.tdk.com/system/files/dam/doc/product/capacitor/ceramic/mlcc/catalog/mlcc_commercial_general_en.pdf>; ARROW_PART_NUMBER: C1005X5R1V225K050BC; ARROW_PRICE-STOCK: https://www.arrow.com/en/products/c1005x5r1v225k050bc/tdk; DESCRIPTION: MULTILAYER CERAMIC CHIP CAPACITORS, 1005, Commercial grade, general (Up to 75V); HEIGHT: 0.55mm; MANUFACTURER_NAME: TDK; MANUFACTURER_PART_NUMBER: C1005X5R1V225K050BC; MOUSER_PART_NUMBER: 810-C1005X5R1V225K; MOUSER_PRICE-STOCK: https://www.mouser.co.uk/ProductDetail/TDK/C1005X5R1V225K050BC?qs=dfay7wIA1uHOji3UDo6xhw%3D%3D
C10-C15 = GRM188R60J226ME15D:GRM188R60J226ME15D: Multilayer Ceramic Capacitors MLCC - SMD/SMT Source: Datasheet <http://componentsearchengine.com/Datasheets/1/GRM188R60J226ME15D.pdf>; ARROW_PART_NUMBER: GRM188R60J226ME15D; ARROW_PRICE-STOCK: https://www.arrow.com/en/products/grm188r60j226me15d/murata-manufacturing; DESCRIPTION: Multilayer Ceramic Capacitors MLCC - SMD/SMT; HEIGHT: 0.9mm; MANUFACTURER_NAME: Murata Electronics; MANUFACTURER_PART_NUMBER: GRM188R60J226ME15D; MOUSER_PART_NUMBER: 81-GRM188R60J226ME5D; MOUSER_PRICE-STOCK: https://www.mouser.co.uk/ProductDetail/Murata-Electronics/GRM188R60J226ME15D/?qs=84nSAGdh8NVUbroaMW6uAg%3D%3D
C17-C19 C23 C26-C28 C31-C36 = C0603H103J3GAC:C0603H103J3GAC: Kemet 0603 C 10nF Ceramic Multilayer Capacitor, 25 V dc, +200C, C0G Dielectric, +/-5% Source: Datasheet <https://connect.kemet.com:7667/gateway/IntelliData-ComponentDocumentation/1.0/download/specsheet/C0603H103J3GAC{BULK}>; DESCRIPTION: Kemet 0603 C 10nF Ceramic Multilayer Capacitor, 25 V dc, +200C, C0G Dielectric, +/-5%; HEIGHT: 0.87mm; MANUFACTURER_NAME: Kemet; MANUFACTURER_PART_NUMBER: C0603H103J3GAC
C40 = C0805C125K4RACTU:C0805C125K4RACTU: Multilayer Ceramic Capacitors MLCC - SMD/SMT 16volts 1.2uF X7R 10% Source: Datasheet <https://componentsearchengine.com/Datasheets/1/C0805C125K4RACTU.pdf>; ARROW_PART_NUMBER: C0805C125K4RACTU; ARROW_PRICE-STOCK: https://www.arrow.com/en/products/c0805c125k4ractu/kemet-corporation; DESCRIPTION: Multilayer Ceramic Capacitors MLCC - SMD/SMT 16volts 1.2uF X7R 10%; HEIGHT: 0.88mm; MANUFACTURER_NAME: Kemet; MANUFACTURER_PART_NUMBER: C0805C125K4RACTU; MOUSER_PART_NUMBER: 80-C0805C125K4R; MOUSER_PRICE-STOCK: https://www.mouser.com/Search/Refine.aspx?Keyword=80-C0805C125K4R
C41-C54 C56-C60 = rcl:C-EU: CAPACITOR, European symbol; SPICEPREFIX: C
C55 = adafruit:C-US: CAPACITOR, American symbol
D1-D3 = VEMD8080:VEMD8080: Photodiodes Pin Photodiode 20V 350-1100nm; 28uA Source: Datasheet <https://www.vishay.com/docs/84565/vemd8080.pdf>; ARROW_PART_NUMBER: VEMD8080; ARROW_PRICE-STOCK: https://www.arrow.com/en/products/vemd8080/vishay?region=nac; DESCRIPTION: Photodiodes Pin Photodiode 20V 350-1100nm; 28uA; HEIGHT: 0.53mm; MANUFACTURER_NAME: Vishay; MANUFACTURER_PART_NUMBER: VEMD8080; MOUSER_PART_NUMBER: 78-VEMD8080; MOUSER_PRICE-STOCK: https://www.mouser.co.uk/ProductDetail/Vishay-Semiconductors/VEMD8080?qs=F5EMLAvA7IBCchs2bw9l%2Fw%3D%3D
D4 = diode:CGRM400*-G: Molded plasitc,JEDEC SOD-123/Mini SMA Source: Comchip CGRM4001-G.pdf
D5-D11 = TESD5V0L1UC_RJG:TESD5V0L1UC_RJG: Check availability <https://pricing.snapeda.com/parts/TESD5V0L1UC%20RJG/Taiwan%20Semiconductor%20Corporation/view-part?ref=eda>; AVAILABILITY: In Stock; DESCRIPTION: DFN1006L, 5V, 100W, 2pF, ESD Protection Diode & Array; MF: Taiwan Semiconductor Corporation; MP: TESD5V0L1UC RJG; PACKAGE: DFN1006L Taiwan Semiconductor; PRICE: None; PURCHASE-URL: https://pricing.snapeda.com/search/part/TESD5V0L1UC RJG/?ref=eda
IC1 = MAX14745JEWX+T:MAX14745JEWX+T: Battery Management Wearable Charge Management Solution Source: Datasheet <https://pdfserv.maximintegrated.com/en/ds/MAX14745.pdf>; DESCRIPTION: Battery Management Wearable Charge Management Solution; HEIGHT: 0.69mm; MANUFACTURER_NAME: Maxim Integrated; MANUFACTURER_PART_NUMBER: MAX14745JEWX+T; MOUSER_PART_NUMBER: 700-MAX14745JEWX+T; MOUSER_PRICE-STOCK: https://www.mouser.com/Search/Refine.aspx?Keyword=700-MAX14745JEWX%2BT
IC2 = MAX86178ENJ+:MAX86178ENJ+: Ultra-Low-Power, Clinical-Grade Vital-Sign AFE Source: Datasheet <https://g.componentsearchengine.com/Datasheets/0/15123195.pdf>; DESCRIPTION: Ultra-Low-Power, Clinical-Grade Vital-Sign AFE; HEIGHT: 0.5mm; MANUFACTURER_NAME: Maxim Integrated; MANUFACTURER_PART_NUMBER: MAX86178ENJ+; MOUSER_PART_NUMBER: N/A; MOUSER_PRICE-STOCK: https://www.mouser.co.uk/ProductDetail/Maxim-Integrated/MAX86178ENJ%2b?qs=A6eO%252BMLsxmRF4ok651ufOA%3D%3D
IC4 = MLX90632SLD-DCB-100-SP:MLX90632SLD-DCB-100-SP: Board Mount Temperature Sensors single pixel, SMD, medical acc., 50deg FoV, 1.8V I2C Source: Datasheet <https://gr.mouser.com/datasheet/2/734/MLX90632_Datasheet_Melexis-1595868.pdf>; DESCRIPTION: Board Mount Temperature Sensors single pixel, SMD, medical acc., 50deg FoV, 1.8V I2C; HEIGHT: 1mm; MANUFACTURER_NAME: Melexis; MANUFACTURER_PART_NUMBER: MLX90632SLD-DCB-100-SP; MOUSER_PART_NUMBER: 482-90632SLDDCB100SP; MOUSER_PRICE-STOCK: https://www.mouser.co.uk/ProductDetail/Melexis/MLX90632SLD-DCB-100-SP?qs=W%2FMpXkg%252BdQ6VXghbjaLHHg%3D%3D
IC6 = 74HC157D:74HC157D: NXP 74HC157D, Encoder Quad 2:1 Multiplexer, 5 V, 16-Pin SOIC Source: Datasheet; DESCRIPTION: NXP 74HC157D, Encoder Quad 2:1 Multiplexer, 5 V, 16-Pin SOIC; HEIGHT: mm; MANUFACTURER_NAME: Nexperia; MANUFACTURER_PART_NUMBER: 74HC157D; MOUSER_PART_NUMBER: 771-74HC157D; MOUSER_PRICE-STOCK: https://www.mouser.com/Search/Refine.aspx?Keyword=771-74HC157D
JP1 = Connector:PINHD-1X8: PIN HEADER; CATEGORY: CONNECTOR; SUB-CATEGORY: PIN-HEADER
JP2 = Connector:PINHD-1X4: PIN HEADER; CATEGORY: CONNECTOR; SUB-CATEGORY: PIN-HEADER
JP3 JP8 JP10 = Connector:PINHD-1X3: PIN HEADER; CATEGORY: CONNECTOR; SUB-CATEGORY: PIN-HEADER
JP4 = pinhead:PINHD-1X4: PIN HEADER
JP5 JP6 JP10/FTDI = pinhead:PINHD-1X6: PIN HEADER
JP7 JP9 JP11 JP12 = Connector:PINHD-1X2: PIN HEADER; CATEGORY: CONNECTOR; SUB-CATEGORY: PIN-HEADER
L1-L3 = DFE201610E-2R2M=P2:DFE201610E-2R2M=P2: DFE201610E Series Inductor 2.2uH +/-20% 0806 (2016) Source: Datasheet <https://psearch.en.murata.com/inductor/product/DFE201610E-2R2M#.html>; ARROW_PART_NUMBER: DFE201610E-2R2M=P2; ARROW_PRICE-STOCK: https://www.arrow.com/en/products/dfe201610e-2r2mp2/murata-manufacturing?region=nac; DESCRIPTION: DFE201610E Series Inductor 2.2uH +/-20% 0806 (2016); HEIGHT: 1mm; MANUFACTURER_NAME: Murata Electronics; MANUFACTURER_PART_NUMBER: DFE201610E-2R2M=P2; MOUSER_PART_NUMBER: 81-DFE201610E-2R2MP2; MOUSER_PRICE-STOCK: https://www.mouser.co.uk/ProductDetail/Murata-Electronics/DFE201610E-2R2M%3dP2?qs=AQlKX63v8Rv49b3hcvXgWQ%3D%3D
LED1 LED2 = LG_L29K-G2J1-24:LG_L29K-G2J1-24: Hyper SMARTLED Green,LG L29K-G2J1-24 Osram Opto LG L29K-G2J1-24, SMARTLED Series Green High-Power LED, 570 nm 1608 (0603), Rectangle Lens SMD package Source: Datasheet <https://dammedia.osram.info/media/resource/hires/osram-dam-5662670/LG L29K_EN.pdf>; ARROW_PART_NUMBER: LG L29K-G2J1-24; ARROW_PRICE-STOCK: https://www.arrow.com/en/products/lg-l29k-g2j1-24/osram-opto-semiconductors?region=nac; DESCRIPTION: Hyper SMARTLED Green,LG L29K-G2J1-24 Osram Opto LG L29K-G2J1-24, SMARTLED Series Green High-Power LED, 570 nm 1608 (0603), Rectangle Lens SMD package; HEIGHT: 0.67mm; MANUFACTURER_NAME: OSRAM; MANUFACTURER_PART_NUMBER: LG L29K-G2J1-24; MOUSER_PART_NUMBER: 720-LGL29KG2J124Z; MOUSER_PRICE-STOCK: https://www.mouser.com/Search/Refine.aspx?Keyword=720-LGL29KG2J124Z
LED3 = SFH_7016:SFH_7016: Infrared Emitters Green / Red / IR LED 530nm, 655nm, 940nm Source: Datasheet <https://www.mouser.co.uk/ProductDetail/OSRAM-Opto-Semiconductors/SFH-7016?qs=OTrKUuiFdkaz7DXJqRo6mw==>; DESCRIPTION: Infrared Emitters Green / Red / IR LED 530nm, 655nm, 940nm; HEIGHT: 0.7mm; MANUFACTURER_NAME: OSRAM; MANUFACTURER_PART_NUMBER: SFH 7016; MOUSER_PART_NUMBER: 720-SFH7016; MOUSER_PRICE-STOCK: https://www.mouser.co.uk/ProductDetail/OSRAM-Opto-Semiconductors/SFH-7016?qs=OTrKUuiFdkaz7DXJqRo6mw%3D%3D
PAD1-PAD3 = wirepad:SMD5: SMD PAD
QF1 = crystal:8M10AHC49T: Monolithic Crystal Filters Source: www.vanlong.com; OC_FARNELL: unknown; OC_NEWARK: unknown
R1-R23 R34 R35 R37-R44 R49 = CRCW0402499RFKED:CRCW0402499RFKED: Vishay CRCW Series Thick Film Surface Mount Resistor 0402 Case 499 +/-1% 0.063W +/-100ppm/C Source: Datasheet <http://www.vishay.com/docs/20035/dcrcwe3.pdf>; ARROW_PART_NUMBER: CRCW0402499RFKED; ARROW_PRICE-STOCK: https://www.arrow.com/en/products/crcw0402499rfked/vishay; DESCRIPTION: Vishay CRCW Series Thick Film Surface Mount Resistor 0402 Case 499 +/-1% 0.063W +/-100ppm/C; HEIGHT: 0.4mm; MANUFACTURER_NAME: Vishay; MANUFACTURER_PART_NUMBER: CRCW0402499RFKED; MOUSER_PART_NUMBER: 71-CRCW0402-499-E3; MOUSER_PRICE-STOCK: https://www.mouser.co.uk/ProductDetail/Vishay-Dale/CRCW0402499RFKED?qs=hAuyw6LW%252BLiHBhQKHQmDog%3D%3D
R24-R33 = CRCW060310K0FKEI:CRCW060310K0FKEI: Standard Thick Film Chip Resistors value 10K0 ohm. Source: Datasheet <http://www.vishay.com/docs/20035/dcrcwe3.pdf>; ARROW_PART_NUMBER: CRCW060310K0FKEI; ARROW_PRICE-STOCK: https://www.arrow.com/en/products/crcw060310k0fkei/vishay; DESCRIPTION: Standard Thick Film Chip Resistors value 10K0 ohm.; HEIGHT: 0.5mm; MANUFACTURER_NAME: Vishay; MANUFACTURER_PART_NUMBER: CRCW060310K0FKEI
R36 R45-R48 = adafruit:R-US_: RESISTOR, American symbol
SW1 = adafruit:SPST_TACT: SMT 6mm switch, EVQQ2 series http://www.ladyada.net/library/eagle
U1 = 2022-03-25_09-19-22_Library:MAX32675ATK+; COPYRIGHT: Copyright (C) 2022 Ultra Librarian. All rights reserved.; MANUFACTURER_PART_NUMBER: MAX32675ATK+; MFR_NAME: Maxim Integrated Products
U2 = 2022-03-25_10-27-04_Library:MAX1676EUB+; COPYRIGHT: Copyright (C) 2022 Ultra Librarian. All rights reserved.; MANUFACTURER_PART_NUMBER: MAX1676EUB+; MFR_NAME: Maxim Integrated Products
U$1 = SON127P600X800X80-9N:FLASH
U$2 = con-molex-usb:MICRO-USB-RECEPTACLE: MICRO USB RECEPTACLES Micro-USB Receptacles, SMT, Lead-Free from MOLEX <http://www.molex.com/>. (C) 2014 Tomasz Boleslaw CEDRO, cederom@tlen.pl, http://www.tomek.cedro.info. Version 0.1 (2014-01-17): Initial release. Version 0.2 (2014-02-06): Updated 47589-0001 footprint pins/pads/milling. Following devices are included: 1. 47589-0001 Micro-USB AB Receptacle, Bottom Mount, SMT, Lead-Free <http://www.molex.com/molex/products/datasheet.jsp?part=active/0475890001_IO_CONNECTORS.xml> (Technical Drawing <http://www.molex.com/pdm_docs/sd/475890001_sd.pdf>).
X1 X2 = adafruit:SMACONNECTOR: SMA Connector 90° DIP SMA Connector, 50 Ohm (4UConnector: 07259)